# EAGLE design schema-projet-elec (EAGLE 9.6.2)
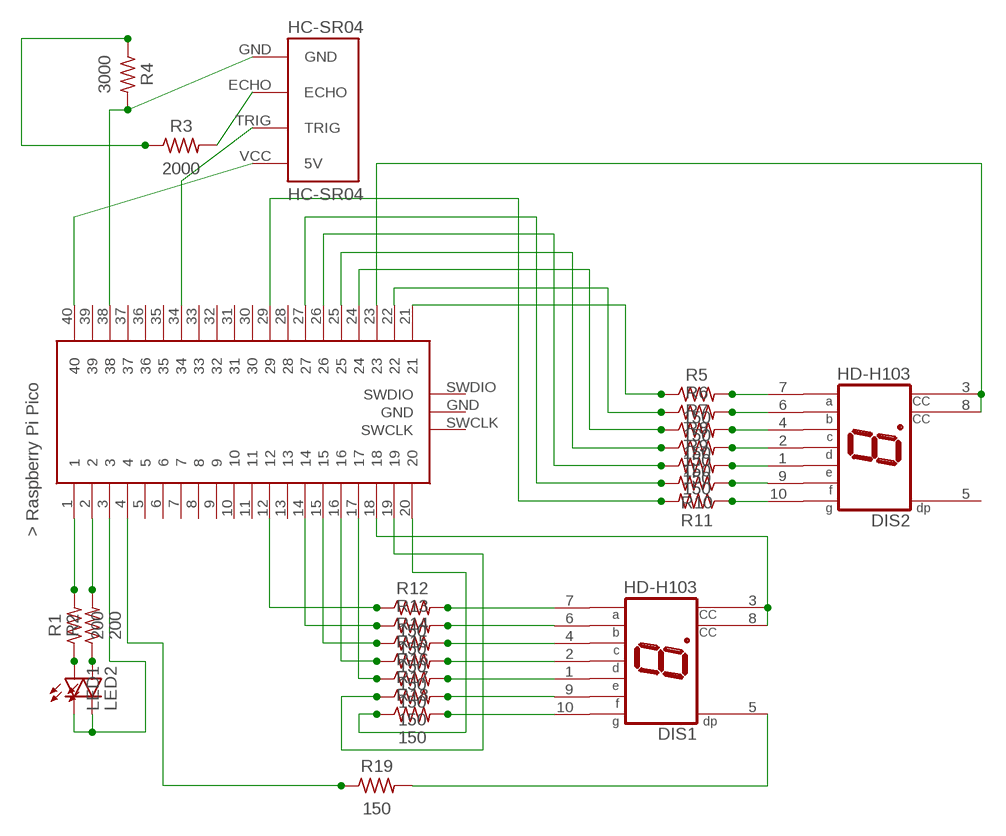
[diagram p0: schematic, sheet 1]

## Parts
DIS1  HD-H103  [HDSP-M]
DIS2  HD-H103  [HDSP-M]
HC-SR04  HC-SR04  [HC-SR04_FOOTPRINT]
LED1  LED5MM  [LED5MM]
LED2  LED5MM  [LED5MM]
R1  200  R-US_AXIAL-7.2MM-PITCH  [RESAD724W46L381D178B]
R2  200  R-US_AXIAL-7.2MM-PITCH  [RESAD724W46L381D178B]
R3  2000  R-US_AXIAL-7.2MM-PITCH  [RESAD724W46L381D178B]
R4  3000  R-US_AXIAL-7.2MM-PITCH  [RESAD724W46L381D178B]
R5  150  R-US_AXIAL-7.2MM-PITCH  [RESAD724W46L381D178B]
R6  150  R-US_AXIAL-7.2MM-PITCH  [RESAD724W46L381D178B]
R7  150  R-US_AXIAL-7.2MM-PITCH  [RESAD724W46L381D178B]
R8  150  R-US_AXIAL-7.2MM-PITCH  [RESAD724W46L381D178B]
R9  150  R-US_AXIAL-7.2MM-PITCH  [RESAD724W46L381D178B]
R10  150  R-US_AXIAL-7.2MM-PITCH  [RESAD724W46L381D178B]
R11  150  R-US_AXIAL-7.2MM-PITCH  [RESAD724W46L381D178B]
R12  150  R-US_AXIAL-7.2MM-PITCH  [RESAD724W46L381D178B]
R13  150  R-US_AXIAL-7.2MM-PITCH  [RESAD724W46L381D178B]
R14  150  R-US_AXIAL-7.2MM-PITCH  [RESAD724W46L381D178B]
R15  150  R-US_AXIAL-7.2MM-PITCH  [RESAD724W46L381D178B]
R16  150  R-US_AXIAL-7.2MM-PITCH  [RESAD724W46L381D178B]
R17  150  R-US_AXIAL-7.2MM-PITCH  [RESAD724W46L381D178B]
R18  150  R-US_AXIAL-7.2MM-PITCH  [RESAD724W46L381D178B]
R19  150  R-US_AXIAL-7.2MM-PITCH  [RESAD724W46L381D178B]
U$1  RASPBERRY-PI-PICO_TH  [FT_RASPBERRY-PI-PICO_TH]

## Nets
N$1: R1.2 U$1.1
N$2: LED1.A R1.1
N$3: R2.2 U$1.2
N$4: LED2.A R2.1
N$5: LED1.K(C) LED2.K(C) U$1.3
N$6: HC-SR04.VCC(5V) U$1.40
N$7: HC-SR04.GND R4.2 U$1.38
N$8: HC-SR04.ECHO R3.2
N$9: R3.1 R4.1
N$10: DIS2.7(A) R5.2
N$11: HC-SR04.TRIG U$1.34
N$12: DIS2.6(B) R6.2
N$13: DIS2.4(C) R7.2
N$14: DIS2.2(D) R8.2
N$15: DIS2.1(E) R9.2
N$16: DIS2.9(F) R10.1
N$17: DIS2.10(G) R11.1
N$18: R12.1 U$1.12
N$19: R13.1 U$1.14
N$20: R14.1 U$1.15
N$21: R16.1 U$1.17
N$22: R15.1 U$1.16
N$25: DIS1.10(G) R18.2
N$26: DIS1.9(F) R17.2
N$27: DIS1.1(E) R16.2
N$28: DIS1.2(D) R15.2
N$29: DIS1.4(C) R14.2
N$30: DIS1.6(B) R13.2
N$31: DIS1.7(A) R12.2
N$32: R11.2 U$1.29
N$33: R10.2 U$1.27
N$34: R9.1 U$1.26
N$35: R8.1 U$1.25
N$36: R7.1 U$1.24
N$37: R6.1 U$1.22
N$38: R5.1 U$1.21
N$39: R17.1 U$1.19
N$40: R19.1 U$1.4
N$41: DIS1.5(DP) R19.2
N$42: DIS1.3(CC) DIS1.8(CC) U$1.18
N$43: R18.1 U$1.20
N$44: DIS2.3(CC) DIS2.8(CC) U$1.23
Unconnected: DIS2.5(DP) U$1.5 U$1.6 U$1.7 U$1.8 U$1.9 U$1.10 U$1.11 U$1.13 U$1.28 U$1.30 U$1.31 U$1.32 U$1.33 U$1.35 U$1.36 U$1.37 U$1.39 U$1.GND U$1.SWCLK U$1.SWDIO

## Library data of the parts
DIS1 DIS2 = display-hp:HD-H103: LED DISPLAY 1-character 7 segment, decimal point right; OC_FARNELL: unknown; OC_NEWARK: unknown
HC-SR04 = hc-sr04:HC-SR04: Ultrasonic Sensor HC-SR04
LED1 LED2 = led:LED: LED OSRAM: - CHIPLED LG R971, LG N971, LY N971, LG Q971, LY Q971, LO R971, LY R971 LH N974, LH R974 LS Q976, LO Q976, LY Q976 LO Q996 - Hyper CHIPLED LW Q18S LB Q993, LB Q99A, LB R99A - SideLED LS A670, LO A670, LY A670, LG A670, LP A670 LB A673, LV A673, LT A673, LW A673 LH A674 LY A675 LS A676, LA A676, LO A676, LY A676, LW A676 LS A679, LY A679, LG A679 - Hyper Micro SIDELED® LS Y876, LA Y876, LO Y876, LY Y876 LT Y87S - SmartLED LW L88C, LW L88S LB L89C, LB L89S, LG L890 LS L89K, LO L89K, LY L89K LS L896, LA L896, LO L896, LY L896 - TOPLED LS T670, LO T670, LY T670, LG T670, LP T670 LSG T670, LSP T670, LSY T670, LOP T670, LYG T670 LG T671, LOG T671, LSG T671 LB T673, LV T673, LT T673, LW T673 LH T674 LS T676, LA T676, LO T676, LY T676, LB T676, LH T676, LSB T676, LW T676 LB T67C, LV T67C, LT T67C, LS T67K, LO T67K, LY T67K, LW E67C LS E67B, LA E67B, LO E67B, LY E67B, LB E67C, LV E67C, LT E67C LW T67C LS T679, LY T679, LG T679 LS T770, LO T770, LY T770, LG T770, LP T770 LB T773, LV T773, LT T773, LW T773 LH T774 LS E675, LA E675, LY E675, LS T675 LS T776, LA T776, LO T776, LY T776, LB T776 LHGB T686 LT T68C, LB T68C - Hyper Mini TOPLED® LB M676 - Mini TOPLED Santana® LG M470 LS M47K, LO M47K, LY M47K Source: http://www.osram.convergy.de LUXEON: - LUMILED® LXK2-PW12-R00, LXK2-PW12-S00, LXK2-PW14-U00, LXK2-PW14-V00 LXK2-PM12-R00, LXK2-PM12-S00, LXK2-PM14-U00 LXK2-PE12-Q00, LXK2-PE12-R00, LXK2-PE12-S00, LXK2-PE14-T00, LXK2-PE14-U00 LXK2-PB12-K00, LXK2-PB12-L00, LXK2-PB12-M00, LXK2-PB14-N00, LXK2-PB14-P00, LXK2-PB14-Q00 LXK2-PR12-L00, LXK2-PR12-M00, LXK2-PR14-Q00, LXK2-PR14-R00 LXK2-PD12-Q00, LXK2-PD12-R00, LXK2-PD12-S00 LXK2-PH12-R00, LXK2-PH12-S00 LXK2-PL12-P00, LXK2-PL12-Q00, LXK2-PL12-R00 Source: www.luxeon.com KINGBRIGHT: KA-3528ASYC Source: www.kingbright.com
R1-R19 = Resistor:R-US: Resistor Fixed - ANSI; CATEGORY: Resistor; SUB-CATEGORY: Fixed
U$1 = pipico:RASPBERRY-PI-PICO_TH: Raspberry Pi Pico microcontroller board for through-hole mounting.

## Board
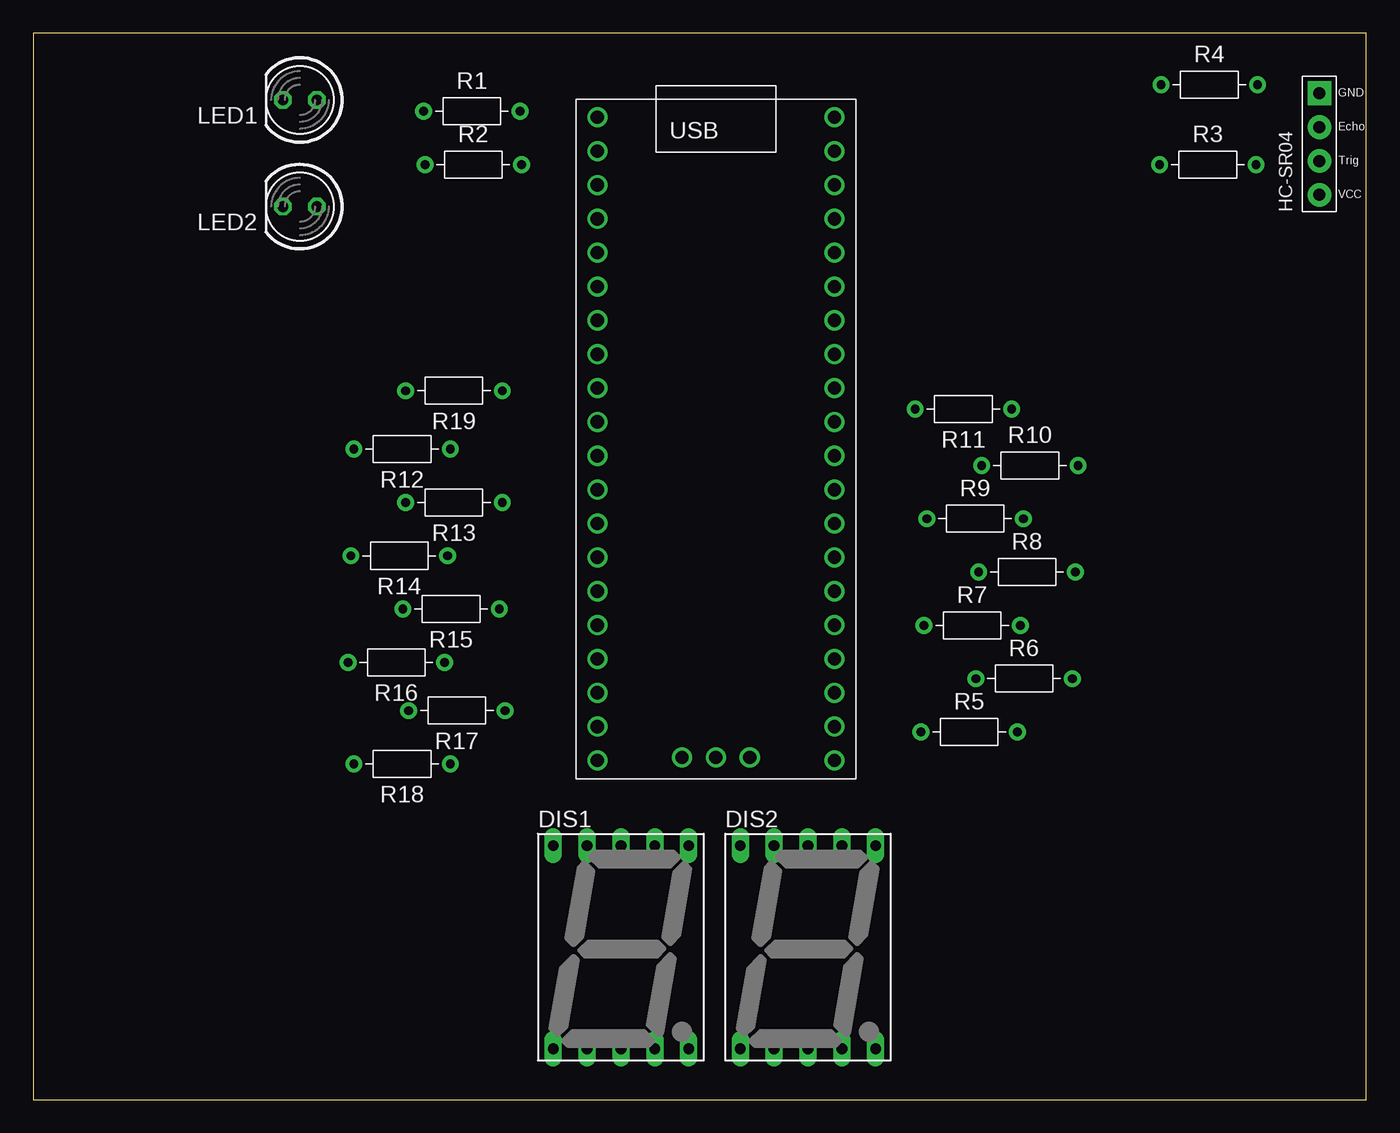
[diagram p1: board, top side]
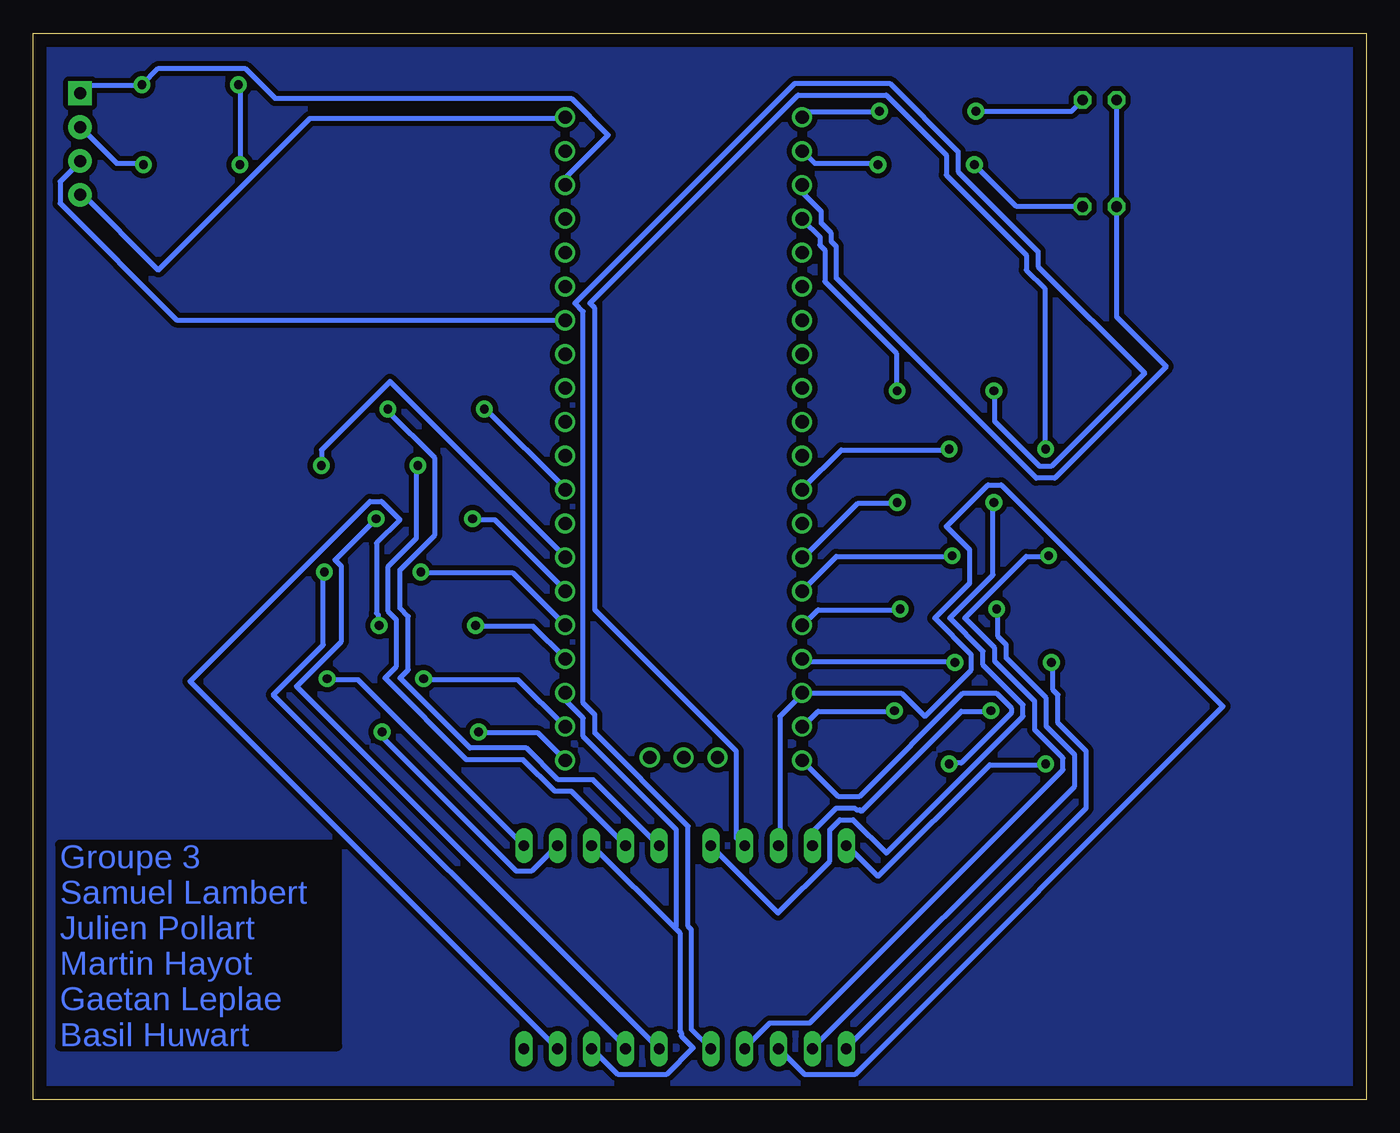
[diagram p2: board, bottom side, seen from below]

Size 100 x 80 mm. Coordinates in mm from the lower left corner, seen from the top.
Outline: 0,0 100,0 100,80 0,80 0,0
Copper layers (1*16): Top 0.035mm / dielectric 1.5mm / Bottom 0.035mm
Design rules "default *": minimum track width 15mil, minimum drill 0.35mm, track to track 15mil, track to pad 15mil, pad to pad 15mil, via to via 15mil, smd to smd 6mil, copper to edge 40mil, drill to drill 6mil, minimum pad ring 10mil, minimum via ring 8mil, stop-mask expansion 4mil, vias tented up to drill 0mil, thermal gap 10mil

### Footprints (pad centres in the part's own frame; a part is rotated, then mirrored left to right if it is on the bottom)
HDSP-M = drill 0.813 long: 1 -5.08,-7.62; 2 -2.54,-7.62; 3 0,-7.62; 4 2.54,-7.62; 5 5.08,-7.62; 6 5.08,7.62; 7 2.54,7.62; 8 0,7.62; 9 -2.54,7.62; 10 -5.08,7.62
HC-SR04_FOOTPRINT = drill 0.9 pad 1.778: ECHO 0,1.27; TRIG 0,-1.27; VCC 0,-3.81 | drill 0.9 pad 1.778 square: GND 0,3.81
LED5MM = drill 0.813 octagon: A -1.27,0; K 1.27,0
RESAD724W46L381D178B = drill 0.66 pad 1.26: 1 -3.62,0; 2 3.62,0
FT_RASPBERRY-PI-PICO_TH = drill 1: 1 -8.55,24.03; 2 -8.55,21.49; 3 -8.55,18.95; 4 -8.55,16.41; 5 -8.55,13.87; 6 -8.55,11.33; 7 -8.55,8.79; 8 -8.55,6.25; 9 -8.55,3.71; 10 -8.55,1.17; 11 -8.55,-1.37; 12 -8.55,-3.91; 13 -8.55,-6.45; 14 -8.55,-8.99; 15 -8.55,-11.53; 16 -8.55,-14.07; 17 -8.55,-16.61; 18 -8.55,-19.15; 19 -8.55,-21.69; 20 -8.55,-24.23; 21 9.23,-24.23; 22 9.23,-21.69; 23 9.23,-19.15; 24 9.23,-16.61; 25 9.23,-14.07; 26 9.23,-11.53; 27 9.23,-8.99; 28 9.23,-6.45; 29 9.23,-3.91; 30 9.23,-1.37; 31 9.23,1.17; 32 9.23,3.71; 33 9.23,6.25; 34 9.23,8.79; 35 9.23,11.33; 36 9.23,13.87; 37 9.23,16.41; 38 9.23,18.95; 39 9.23,21.49; 40 9.23,24.03; GND 0.34,-24; SWCLK -2.2,-24; SWDIO 2.88,-24

### Placement (x,y rotation side)
DIS1  44.09,11.43 0 top
DIS2  58.12,11.43 0 top
HC-SR04  96.49,71.69 0 top
LED1  20,75 180 top
LED2  20,67 180 top
R1  32.9,74.15 0 top
R2  33.01,70.15 0 top
R3  88.12,70.15 0 top
R4  88.23,76.15 0 top
R5  70.22,27.58 0 top
R6  74.33,31.58 0 top
R7  70.44,35.58 0 top
R8  74.55,39.58 0 top
R9  70.66,43.58 0 top
R10  74.77,47.58 0 top
R11  69.78,51.8 180 top
R12  27.67,48.8 180 top
R13  31.56,44.8 180 top
R14  27.45,40.8 180 top
R15  31.34,36.8 180 top
R16  27.23,32.8 180 top
R17  31.78,29.18 180 top
R18  27.67,25.18 180 top
R19  31.56,53.18 180 top
U$1  50.87,49.67 0 top

### Tracks (layer width: path | path; a pad name or v marks a point on that pad's centre or on a via)
GND
  pour Bottom: 100,80 100,0 0,0 0,80
N$1
  Bottom 0.381: R1.2 36.62,74.12 41.88,74.12 42.25,73.75 U$1.1
N$2
  Bottom 0.381: R1.1 22.12,74.15 LED1.A
N$3
  Bottom 0.381: R2.2 36.75,70.25 41.38,70.25 42.25,71.12 U$1.2
N$4
  Bottom 0.381: LED2.A 26.24,67 R2.1
N$5
  Bottom 0.381: U$1.3 42.25,68.5 42.25,68 40.88,66.62 40.88,65.75 40.12,65 40.12,64.38 39.75,64 39.75,61.62 24.75,46.62 23.38,46.62 15,55 18.73,58.73 LED2.K LED1.K
N$6
  Bottom 0.381: U$1.40 60.12,73.62 79.25,73.62 90.62,62.25 96.38,68 HC-SR04.VCC
N$7
  Bottom 0.381: HC-SR04.GND 96.38,75.5 95.75,76.12 91.88,76.12 R4.2 90.62,77.38 84.12,77.38 81.88,75.12 59.62,75.12 56.88,72.38 60,69.25 60,68.62 U$1.38
N$8
  Bottom 0.381: R3.2 91.75,70.25 93.75,70.25 96.38,72.88 HC-SR04.ECHO
N$9
  Bottom 0.381: R3.1 84.5,76.12 R4.1
N$10
  Bottom 0.381: R5.2 73.75,27.5 73.75,27.12 63.75,17.12 62.62,17.12 60.75,19 DIS2.7
N$11
  Bottom 0.381: U$1.34 60.12,58.5 89.25,58.5 98,67.25 98,68.88 96.5,70.38 HC-SR04.TRIG
N$12
  Bottom 0.381: R6.2 77.88,31.5 75.62,31.5 63.25,19.12 DIS2.6
N$13
  Bottom 0.381: R7.2 74.12,35.62 74.12,36.38 74.25,36.5 74.25,41.75 72.5,43.5 73.88,44.88 74.75,44.88 88.25,31.38 60.75,3.88 DIS2.4
N$14
  Bottom 0.381: R8.2 78.25,39.5 78.25,34.12 82,30.38 55.5,3.88 DIS2.2
N$15
  Bottom 0.381: R9.2 74.38,43.5 77.38,40.5 76.88,40 76.88,34.38 80.25,31 53.12,3.88 DIS2.1
N$16
  Bottom 0.381: R10.1 71.25,47.5 71.25,42.12 73.38,40 73.38,36.62 72.75,36 72.75,32.5 73.62,31.62 67.5,25.5 63.25,25.5 60.88,23.12 59.62,23.12 55.62,19.12 DIS2.9
N$17
  Bottom 0.381: R11.1 73.38,51.75 73.38,51.62 69.88,48.12 69.88,42.38 72.5,39.75 72.5,36.88 71.88,36.25 71.88,32.25 72.5,31.62 67.25,26.38 63,26.38 60.62,24 58,24 53.12,19.12 DIS2.10
N$18
  Bottom 0.381: R12.1 31.38,48.75 39.38,48.75 42.25,45.88 U$1.12
N$19
  Bottom 0.381: R13.1 35.25,44.75 38.12,44.75 42.25,40.62 U$1.14
N$20
  Bottom 0.381: R14.1 31.12,40.75 39.75,40.75 42.25,38.25 U$1.15
N$21
  Bottom 0.381: R16.1 30.88,32.88 42.12,32.88 42.25,33 U$1.17
N$22
  Bottom 0.381: R15.1 35,36.75 41.12,36.75 42.25,35.62 U$1.16
N$25
  Bottom 0.381: R18.2 24.12,25.12 28.25,25.12 36.62,16.75 39,19.12 DIS1.10
N$26
  Bottom 0.381: R17.2 28.25,29.12 30.38,29.12 37.88,21.62 38,21.75 38.25,21.75 38.38,21.88 39.75,21.88 42,19.62 41.5,19.12 DIS1.9
N$27
  Bottom 0.381: R16.2 23.5,32.75 23.5,30.75 23.12,30.38 23.12,28.25 21,26.12 21,21.88 39,3.88 DIS1.1
N$28
  Bottom 0.381: R15.2 27.62,36.75 27.62,34.75 27,34.12 27,33.12 24,30.12 24,28 21.88,25.88 21.88,23.5 41.5,3.88 DIS1.2
N$29
  Bottom 0.381: R14.2 23.88,40.75 25.5,40.75 30.12,36.12 27.88,33.88 27.88,32.88 24.88,29.88 24.88,27.75 22.75,25.62 22.75,24.75 41.75,5.75 44.75,5.75 46.62,3.88 DIS1.4
N$30
  Bottom 0.381: R13.2 28,44.75 28,39.38 31.25,36.12 28.75,33.62 28.75,32.62 25.75,29.62 25.75,28.75 36,18.5 38.5,21 39.5,21 40.25,20.25 40.25,17.88 44.12,14 49.12,19 DIS1.6
N$31
  Bottom 0.381: R12.2 24.12,48.88 24.12,60.88 25.5,62.25 25.5,63.38 31.5,69.38 31.5,70.88 36,75.38 42.62,75.38 58.25,59.75 57.88,59.38 57.88,36.75 47.25,26.12 47.25,19.62 46.75,19.12 DIS1.7
N$32
  Bottom 0.381: R11.2 66.12,51.75 66,51.75 60.12,45.88 U$1.29
N$33
  Bottom 0.381: R10.2 78.38,47.62 78.38,48.75 73.25,53.88 60.12,40.75 U$1.27
N$34
  Bottom 0.381: R9.1 67,43.5 65.38,43.5 60.12,38.25 U$1.26
N$35
  Bottom 0.381: U$1.25 64,39.5 70.88,39.5 R8.1
N$36
  Bottom 0.381: R7.1 66.75,35.5 62.5,35.5 60.12,33.12 U$1.24
N$37
  Bottom 0.381: R6.1 70.62,31.5 63.62,31.5 60.12,28 U$1.22
N$38
  Bottom 0.381: R5.1 66.5,27.5 62.12,27.5 60.12,25.5 U$1.21
N$39
  Bottom 0.381: R17.1 35.5,29.12 41.12,29.12 42.25,28 U$1.19
N$40
  Bottom 0.381: R19.1 35.25,53.25 35.25,56 40.62,61.38 40.62,63.75 41,64.12 41,64.75 42.25,66 U$1.4
N$41
  Bottom 0.381: R19.2 27.88,53.12 27.88,50.88 24.5,47.5 23.62,47.5 16.62,54.5 24.62,62.5 24.62,63.62 30.62,69.62 30.62,71.12 35.75,76.25 42.88,76.25 59.38,59.75 58.75,59.12 58.75,29.75 57.88,28.88 57.88,27.5 50.88,20.5 50.88,13 50.62,12.75 50.62,5.25 49.25,3.88 DIS1.5
N$42
  Bottom 0.381: DIS1.3 44,3.75 42.12,1.88 38.38,1.88 10.75,29.5 27.38,46.12 28.38,46.12 31.5,43 29.75,41.25 29.75,38.75 32.38,36.12 29.62,33.38 29.62,32.25 33.12,28.75 34.88,30.5 42.25,30.5 U$1.18 42.38,30.38 44,28.75 44,19.12 DIS1.8
N$43
  Bottom 0.381: R18.1 31.25,25.25 30.38,25.25 26.62,29 26.62,29.38 27.75,30.5 30.25,30.5 38,22.75 39.62,22.75 42.25,25.38 U$1.20
N$44
  Bottom 0.381: 51.88,12.88 58,19 DIS2.8 | 51.88,12.88 51.5,12.5 51.5,5.12 51.38,5 51.38,4.75 50.5,3.88 52.5,1.88 56.12,1.88 58,3.75 DIS2.3 | U$1.23 60,30.5 60,29.88 58.75,28.62 58.75,27.25 51.75,20.25 51.75,13 51.88,12.88

### Text on the board
Bottom: Groupe 3 / Samuel Lambert / Julien Pollart / Martin Hayot / Gaetan Leplae / Basil Huwart